# Altium schematic sheet Humidity Regulator.SchDoc
size A3
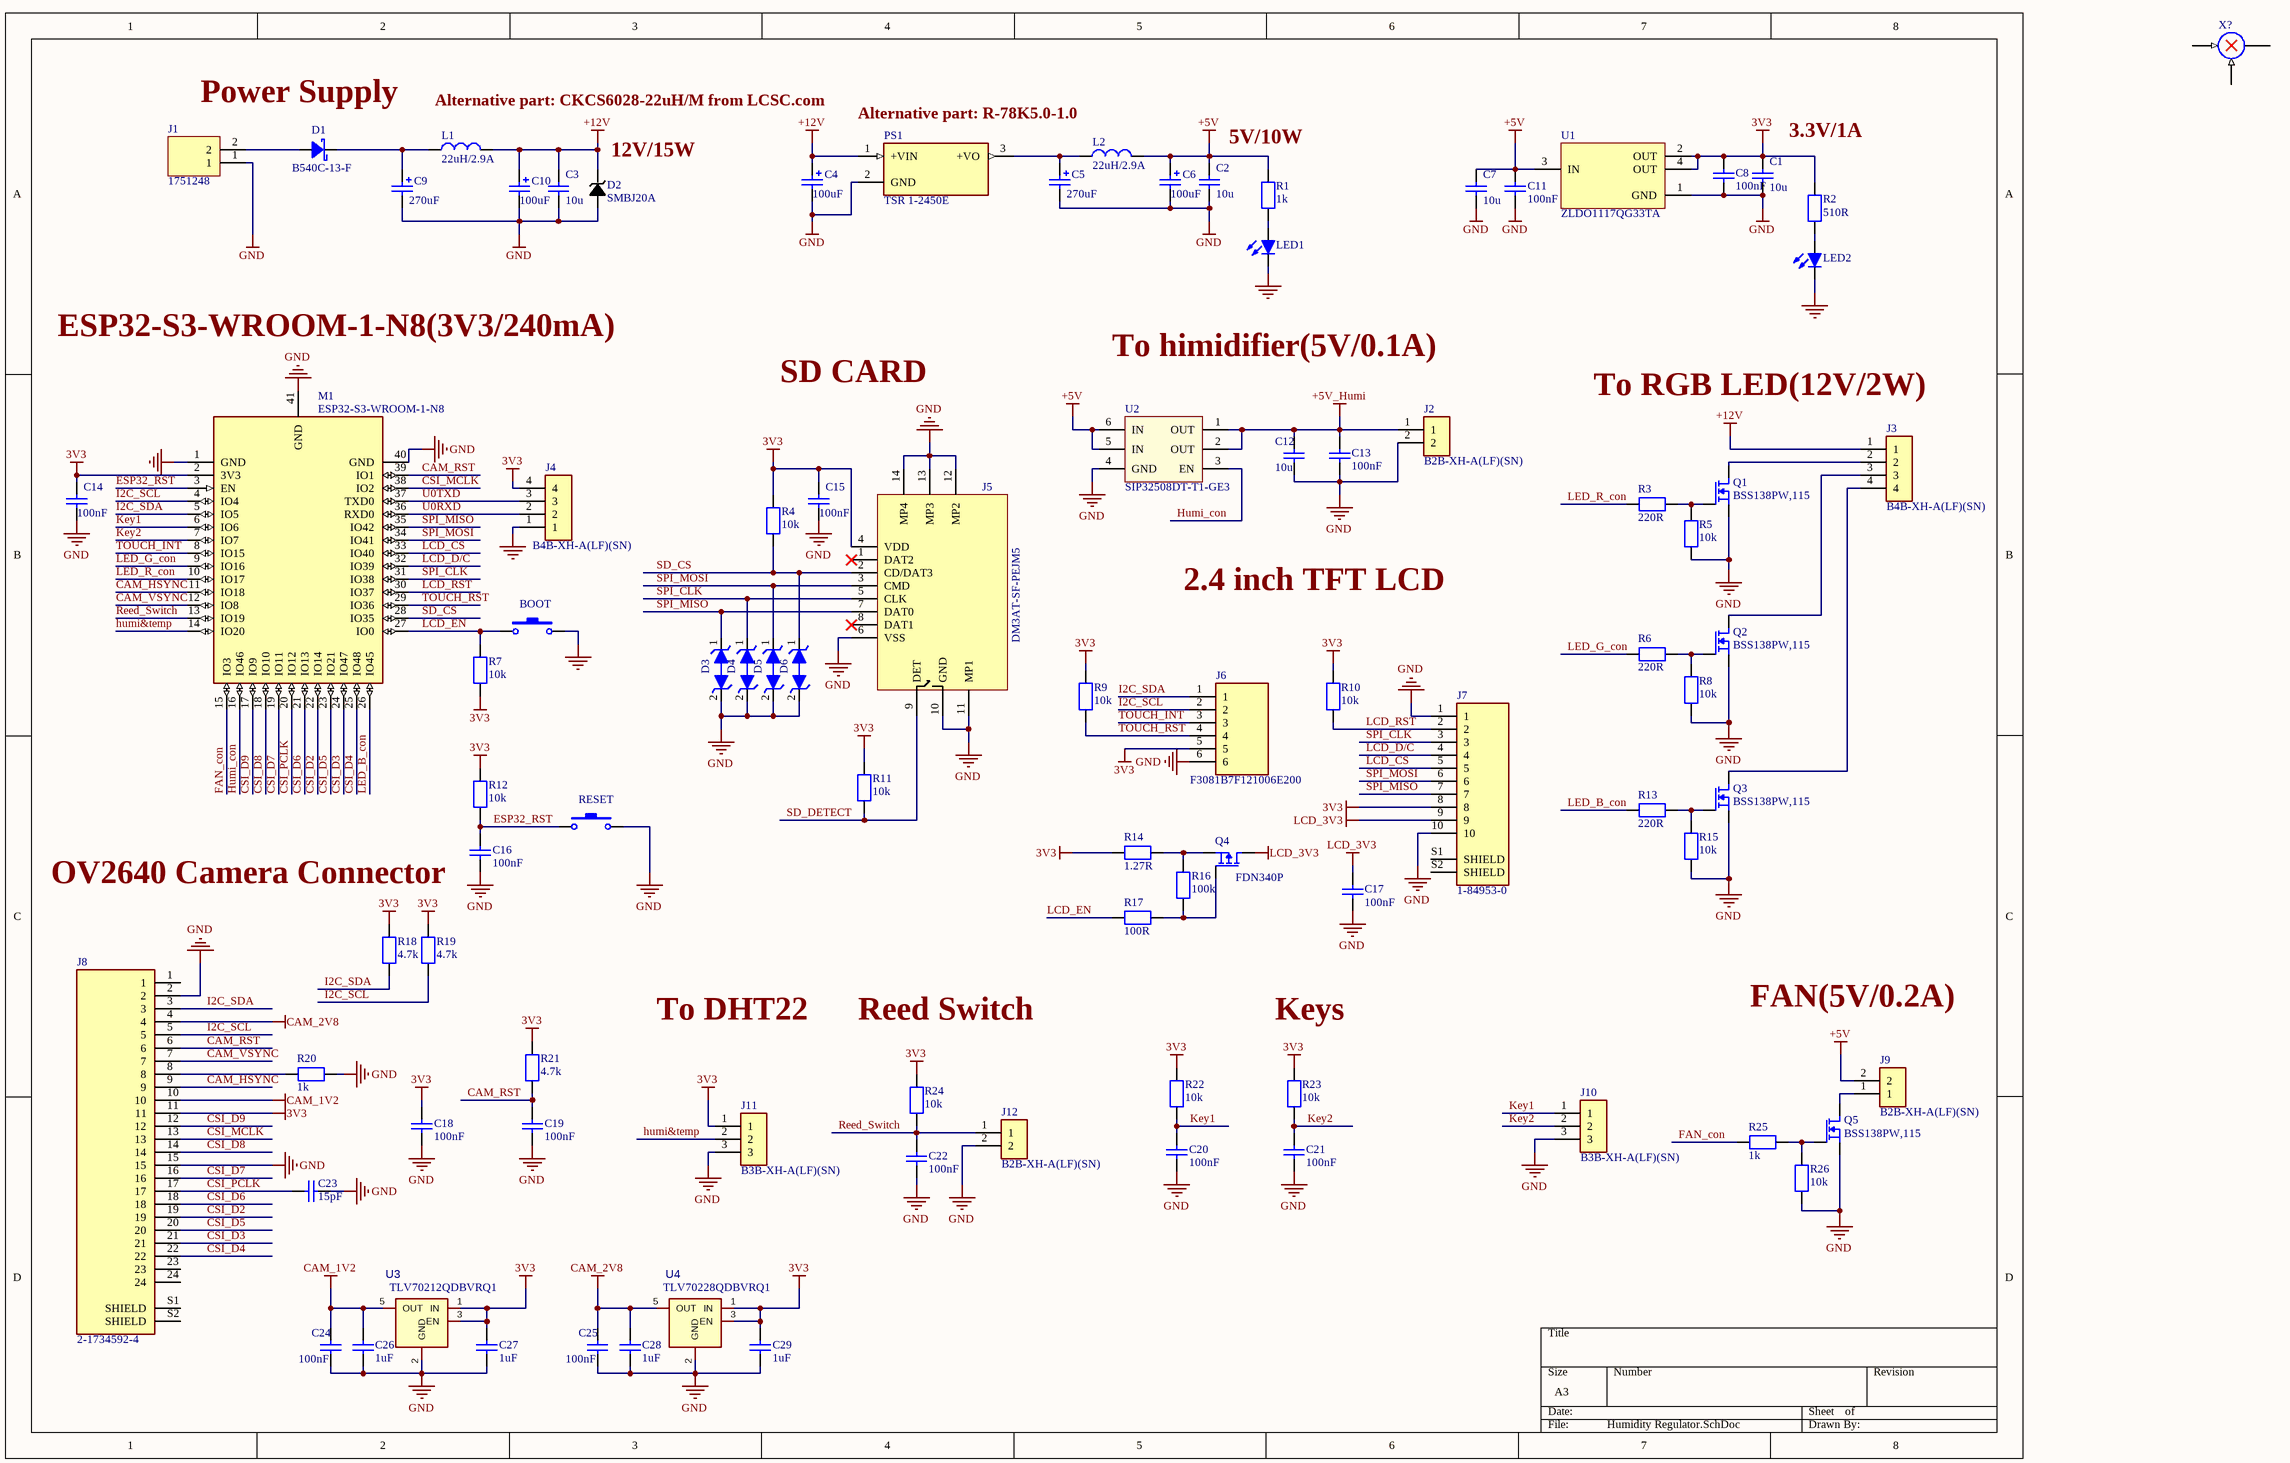
[diagram p0: Humidity Regulator.SchDoc]

## Parts
BOOT  TL3305BF260QG  [SW_TL3305BF260QG]  (value not drawn)
C1  10u  [C1206]
C2  10u  [C1206]
C3  10u  [C1206]
C4  100uF  [CAP_EEUFC1E101S]
C5  270uF  [CAP_EEU-FK1E271B]
C6  100uF  [CAP_EEUFC1E101S]
C7  10u  [C1206]
C8  100nF  [C0603]
C9  270uF  [CAP_EEU-FK1E271B]
C10  100uF  [CAP_EEUFC1E101S]
C11  100nF  [C0603]
C12  10u  [C1206]
C13  100nF  [C0603]
C14  100nF  [C0603]
C15  100nF  [C0603]
C16  100nF  [C0603]
C17  100nF  [C0603]
C18  100nF  [C0603]
C19  100nF  [C0603]
C20  100nF  [C0603]
C21  100nF  [C0603]
C22  100nF  [C0603]
C23  15pF  [C0603]
C24  100nF  [C0603]
C25  100nF  [C0603]
C26  1uF  [C0603]
C27  1uF  [C0603]
C28  1uF  [C0603]
C29  1uF  [C0603]
D1  B540C-13-F  [DO-214AB2]
D2  SMBJ20A  [DO-214AA2]
D3  ESD9B3.3ST5G  [SOD1006X40N_BI]  (value not drawn)
D4  ESD9B3.3ST5G  [SOD1006X40N_BI]  (value not drawn)
D5  ESD9B3.3ST5G  [SOD1006X40N_BI]  (value not drawn)
D6  ESD9B3.3ST5G  [SOD1006X40N_BI]  (value not drawn)
J1  1751248  [1751248]
J2  B2B-XH-A(LF)(SN)  [JST_B2B-XH-A(LF)(SN)]
J3  B4B-XH-A(LF)(SN)  [JST_B4B-XH-A(LF)(SN)]
J4  B4B-XH-A(LF)(SN)  [JST_B4B-XH-A(LF)(SN)]
J5  DM3AT-SF-PEJM5  [HIROSE_DM3AT-SF-PEJM5]
J6  F3081B7F121006E200  [F3081B7F121006E200]
J7  1-84953-0  [TE_1-84953-0]
J8  2-1734592-4  [TE_2-1734592-4]
J9  B2B-XH-A(LF)(SN)  [JST_B2B-XH-A(LF)(SN)]
J10  B3B-XH-A(LF)(SN)  [JST_B3B-XH-A(LF)(SN)]
J11  B3B-XH-A(LF)(SN)  [JST_B3B-XH-A(LF)(SN)]
J12  B2B-XH-A(LF)(SN)  [JST_B2B-XH-A(LF)(SN)]
L1  22uH/2.9A  [IND_SRP6030]
L2  22uH/2.9A  [IND_SRP6030]
LED1  SML-D12U1WT86  [LED0603]  (value not drawn)
LED2  SML-D12U1WT86  [LED0603]  (value not drawn)
M1  ESP32-S3-WROOM-1-N8  [ESP32-S3-WROOM-1-N8]
PS1  TSR 1-2450E  [TSR12450E]
Q1  BSS138PW,115  [SOT323-3]
Q2  BSS138PW,115  [SOT323-3]
Q3  BSS138PW,115  [SOT323-3]
Q4  FDN340P  [SOT23]
Q5  BSS138PW,115  [SOT323-3]
R1  1k  [R0603]
R2  510R  [R0603]
R3  220R  [R0603]
R4  10k  [R0603]
R5  10k  [R0603]
R6  220R  [R0603]
R7  10k  [R0603]
R8  10k  [R0603]
R9  10k  [R0603]
R10  10k  [R0603]
R11  10k  [R0603]
R12  10k  [R0603]
R13  220R  [R0603]
R14  1.27R  [R0603]
R15  10k  [R0603]
R16  100k  [R0603]
R17  100R  [R0603]
R18  4.7k  [R0603]
R19  4.7k  [R0603]
R20  1k  [R0603]
R21  4.7k  [R0603]
R22  10k  [R0603]
R23  10k  [R0603]
R24  10k  [R0603]
R25  1k  [R0603]
R26  10k  [R0603]
RESET  TL3305BF260QG  [SW_TL3305BF260QG]  (value not drawn)
U1  ZLDO1117QG33TA  [SOT223-3]
U2  SIP32508DT-T1-GE3  [TSOT23-6]
U3  TLV70212QDBVRQ1  [SOT23-5]
U4  TLV70228QDBVRQ1  [SOT23-5]
X?  Voltage Multiplier  (value not drawn)

## Nets
3V3: C1.2 C8.2 C14.2 C15.2 C18.2 C27.2 C29.2 J4.4 J5.4(VDD) J6.5 J7.8 J8.11 J11.1 M1.2(3V3) R2.2 R4.1 R7.2 R9.1 R10.1 R11.1 R12.2 R14.1 R18.2 R19.2 R21.2 R22.2 R23.2 R24.2 U1.2(OUT) U1.4(OUT) U3.1(IN) U3.3(EN) U4.1(IN) U4.3(EN)
+5V: C2.2 C6.1 C7.2 C11.2 J9.2 L2.2 R1.2 U1.3(IN) U2.5(IN) U2.6(IN)
+5V_Humi: C12.2 C13.2 J2.1 U2.1(OUT) U2.2(OUT)
+12V: C3.2 C4.1 C10.1 D2.C J3.1 L1.2 PS1.1(+VIN)
CAM_1V2: C24.2 C26.2 J8.10 U3.5(OUT)
CAM_2V8: C25.2 C28.2 J8.4 U4.5(OUT)
GND: BOOT.2 C1.1 C2.1 C3.1 C4.2 C5.2 C6.2 C7.1 C8.1 C9.2 C10.2 C11.1 C12.1 C13.1 C14.1 C15.1 C16.1 C17.1 C18.1 C19.1 C20.1 C21.1 C22.1 C23.1 C24.1 C25.1 C26.1 C27.1 C28.1 C29.1 D2.A D3.2(A) D4.2(A) D5.2(A) D6.2(A) J1.1 J2.2 J4.1 J5.6(VSS) J5.10(GND) J5.11(MP1) J5.12(MP2) J5.13(MP3) J5.14(MP4) J6.6 J7.1 J7.10 J8.2 J8.15 J10.3 J11.3 J12.2 LED1.C LED2.C M1.1(GND) M1.40(GND) M1.41(GND) PS1.2(GND) Q1.2(S) Q2.2(S) Q3.2(S) Q5.2(S) R5.1 R8.1 R15.1 R20.2 R26.1 RESET.2 U1.1(GND) U2.4(GND) U3.2(GND) U4.2(GND)
LCD_3V3: C17.2 J7.9 Q4.3(D)
CAM_HSYNC: J8.9 M1.11(IO18)
CAM_RST: C19.2 J8.6 M1.39(IO1) R21.1
CAM_VSYNC: J8.7 M1.12(IO8)
CSI_D2: J8.19 M1.22(IO14)
CSI_D3: J8.21 M1.24(IO47)
CSI_D4: J8.22 M1.25(IO48)
CSI_D5: J8.20 M1.23(IO21)
CSI_D6: J8.18 M1.21(IO13)
CSI_D7: J8.16 M1.19(IO11)
CSI_D8: J8.14 M1.18(IO10)
CSI_D9: J8.12 M1.17(IO9)
CSI_MCLK: J8.13 M1.38(IO2)
CSI_PCLK: C23.2 J8.17 M1.20(IO12)
ESP32_RST: C16.2 M1.3(EN) R12.1 RESET.1
FAN_con: M1.15(IO3) R25.1
humi&temp: J11.2 M1.14(IO20)
Humi_con: M1.16(IO46) U2.3(EN)
I2C_SCL: J6.2 J8.5 M1.4(IO4) R19.1
I2C_SDA: J6.1 J8.3 M1.5(IO5) R18.1
Key1: C20.2 J10.1 M1.6(IO6) R22.1
Key2: C21.2 J10.2 M1.7(IO7) R23.1
LCD_CS: J7.5 M1.33(IO40)
LCD_D/C: J7.4 M1.32(IO39)
LCD_EN: BOOT.1 M1.27(IO0) R7.1 R17.1
LCD_RST: J7.2 M1.30(IO37) R10.2
LED_B_con: M1.26(IO45) R13.1
LED_G_con: M1.9(IO16) R6.1
LED_R_con: M1.10(IO17) R3.1
Reed_Switch: C22.2 J12.1 M1.13(IO19) R24.1
SD_CS: D6.1(K) J5.2(CD/DAT3) M1.28(IO35) R4.2
SD_DETECT: J5.9(DET) R11.2
SPI_CLK: D4.1(K) J5.5(CLK) J7.3 M1.31(IO38)
SPI_MISO: D3.1(K) J5.7(DAT0) J7.7 M1.35(IO42)
SPI_MOSI: D5.1(K) J5.3(CMD) J7.6 M1.34(IO41)
TOUCH_INT: J6.3 M1.8(IO15)
TOUCH_RST: J6.4 M1.29(IO36) R9.2
U0RXD: J4.2 M1.36(RXD0)
U0TXD: J4.3 M1.37(TXD0)
NetC5_1: C5.1 L2.1 PS1.3(+VO)
NetC9_1: C9.1 D1.C L1.1
NetD1_A: D1.A J1.2
NetJ3_2: J3.2 Q1.3(D)
NetJ3_3: J3.3 Q2.3(D)
NetJ3_4: J3.4 Q3.3(D)
NetJ8_8: J8.8 R20.1
NetJ9_1: J9.1 Q5.3(D)
NetLED1_A: LED1.A R1.1
NetLED2_A: LED2.A R2.1
NetQ1_1: Q1.1(G) R3.2 R5.2
NetQ2_1: Q2.1(G) R6.2 R8.2
NetQ3_1: Q3.1(G) R13.2 R15.2
NetQ4_1: Q4.1(G) R16.1 R17.2
NetQ4_2: Q4.2(S) R14.2 R16.2
NetQ5_1: Q5.1(G) R25.2 R26.2

Not connected (* = marked no-connect by the designer): J5 1(DAT2)* 8(DAT1)*; J7 S1(SHIELD) S2(SHIELD); J8 1 23 24 S1(SHIELD) S2(SHIELD); U3 4(NC); U4 4(NC); X? 1 2 3

## Notes on the sheet
- Power Supply
- (near L1) Alternative part: CKCS6028-22uH/M from LCSC.com
- (near D2) 12V/15W
- Alternative part: R-78K5.0-1.0
- 5V/10W
- 3.3V/1A
- ESP32-S3-WROOM-1-N8(3V3/240mA)
- To himidifier(5V/0.1A)
- SD CARD
- (near J3) To RGB LED(12V/2W)
- 2.4 inch TFT LCD
- OV2640 Camera Connector
- To DHT22
- Reed Switch
- Keys
- FAN(5V/0.2A)

## Library data of the parts
BOOT RESET = TL3305BF260QG: SWITCH TACTILE SPST-NO 0.05A 12V; Manufacturer: E-Switch; Value: TL3305BF260QG; Manufacturer Part Number: TL3305BF260QG; Supplier: Mouser; Supplier Part Number: 612-TL3305BF260QG; Price: 0.25
C1-C3 C7 C12 = 10uF ± 10% 25V: Manufacturer: Yageo; Manufacturer Part Number: CC1206KKX7R8BB106; Tolerance: +-10%; Type: X7R; Voltage (V): 25; Category: Capacitor; Value: 10u; Price: 0.44; Supplier: Mouser; Supplier Part Number: 603-CC126KKX7R8BB106
C4 C6 C10 = EEU-FC1E101S: CAP ALUM 100UF 20% 25V SMD; Manufacturer: Panasonic; Manufacturer Part Number: EEU-FC1E101S; Value: 100uF; Supplier: Mouser; Supplier Part Number: 667-EEU-FC1E101S; Price: 0.4
C5 C9 = EEU-FC1E271B: CAP ALUM 270UF 20% 25V SMD; Manufacturer: Panasonic; Manufacturer Part Number: EEU-FC1E271B; Value: 270uF; Supplier: Mouser; Supplier Part Number: 667-EEU-FC1E271B; Price: 0.7
C8 C11 C13-C22 C24 C25 = 100nF ± 10% 50V: Manufacturer: Yageo; Manufacturer Part Number: CC0603KRX7R9BB104; Value: 100nF; Supplier: Mouser; Supplier Part Number: 603-CC603KRX7R9BB104; Price: 0.1
C23 = 15pF ± 5% 50V: Manufacturer: Yageo; Manufacturer Part Number: CC0603JRNPO9BN150; Value: 15pF; Supplier: Mouser; Supplier Part Number: 603-CC0603JRNPO9BN150; Price: 0.1
C26-C29 = 1uF ± 10% 16V: Manufacturer: Yageo; Manufacturer Part Number: CC0603KRX5R7BB105; Value: 1uF; Supplier: Mouser; Supplier Part Number: 603-CC603KRX5R7BB105; Price: 0.1
D1 = B540C-13-F: Schottky Diodes & Rectifiers 40V 5A; Value: B540C-13-F; Manufacturer Part Number: B540C-13-F; Manufacturer: Diodes; Supplier: Mouser; Supplier Part Number: 621-B540C-F; Price: 0.5
D2 = ZM4746A-GS08: ESD Suppressors / TVS Diodes 600W, 23.4V, 5%, Unidirectional, TVS; Manufacturer: Littelfuse; Value: SMBJ20A; Manufacturer Part Number: SMBJ20A; Supplier: Mouser; Supplier Part Number: 576-SMBJ20A; Price: 0.35
D3-D6 = TVS DIODE 3.3VWM 11.5VC SOD923: 11.5V Clamp 2A (8/20µs) Ipp Tvs Diode Surface Mount SOD-923; Manufacturer: ON Semiconductor; Manufacturer Part Number: ESD9B3.3ST5G; Value: ESD9B3.3ST5G; Supplier: Mouser; Supplier Part Number: 863-ESD9B3.3ST5G; Price: 0.24
J1 = 1751248: PCB terminal block, 3.5mm pitch, 2 way Phoenix Contact COMBICON MKDS Series 3.5mm Pitch Straight PCB Terminal Block with Screw Termination, Through Hole; Supplier Part Number: 651-1751248; Price: 1.2; Manufacturer: Phoenix Contact; Manufacturer Part Number: 1751248; Supplier: Mouser; Value: 1751248
J2 J9 J12 = B2B-XH-A(LF)(SN): Connector Header Through Hole 2 position 0.098 (2.50mm); Manufacturer: JST Sales America Inc.; Value: B2B-XH-A(LF)(SN); Manufacturer Part Number: B2B-XH-A(LF)(SN)
J3 J4 = B4B-XH-A(LF)(SN): Connector Header Through Hole 4 position 0.098 (2.50mm); Manufacturer: JST Sales; Manufacturer Part Number: B4B-XH-A(LF)(SN); Value: B4B-XH-A(LF)(SN)
J5 = CONN MICRO SD CARD PUSH-PUSH R/A: Manufacturer: Hirose Electric Co Ltd; Price: 2.8; Supplier: Mouser; Supplier Part Number: 798-DM3AT-SF-PEJM5; Manufacturer Part Number: DM3AT-SF-PEJM5; Value: DM3AT-SF-PEJM5
J6 = F3081B7F121006E200: FFC & FPC Connectors F308-1B7F1-21006-E20 #VALUE!; Manufacturer: Amphenol Aorora; Manufacturer Part Number: F3081B7F121006E200; Price: 0.507; Value: F3081B7F121006E200; Supplier: Mouser; Supplier Part Number: 649-F3081B7F006E200
J7 = 1-84953-0: FFC & FPC Connectors 1MM CONT ASSY 10P; Manufacturer: TE Connectivity; Manufacturer Part Number: 1-84953-0; Price: 1.05; Value: 1-84953-0; Supplier: Mouser; Supplier Part Number: 571-1-84953-0
J8 = 2-1734592-4: 24 Position FPC Connector Contacts, Bottom 0.020" _0.50mm_ Surface Mount, Right Angle; Manufacturer: TE Connectivity; Manufacturer Part Number: 2-1734592-4; Value: 2-1734592-4; Price: 1.32; Supplier: Mouser; Supplier Part Number: 571-2-1734592-4
J10 J11 = B3B-XH-A(LF)(SN): Connector Header Through Hole 3 position 0.098 (2.50mm); Manufacturer: JST Sales; Value: B3B-XH-A(LF)(SN); Manufacturer Part Number: B3B-XH-A(LF)(SN)
L1 L2 = SRP6030WA-220M: Power Inductors - SMD Ind,7.1x6.6x2.8mm,22uH+/-20%,2.9A,shd; Manufacturer: Bourns; Manufacturer Part Number: SRP6030WA-220M; Value: 22uH/2.9A; Supplier: Mouser; Supplier Part Number: 652-SRP6030WA-220M; Price: 1.2
LED1 LED2 = SML-D12U1WT86: Typical RED GaAs LED; Manufacturer: Rohm Semiconductor; Supplier: Mouser; Supplier Part Number: 755-SML-D12U1WT86; Manufacturer Part Number: SML-D12U1WT86; Value: SML-D12U1WT86; Price: 0.2
M1 = ESP32-S3-WROOM-1-N8: Bluetooth, WiFi 802.11b/g/n, Bluetooth v5.0 Transceiver Module 2.4GHz PCB Trace Surface Mount; Manufacturer: Espressif Systems; Price: 3.45; Value: ESP32-S3-WROOM-1-N8; Supplier Part Number: 356-ESP32-S3WROOM1N8; Manufacturer Part Number: ESP32-S3-WROOM-1-N8; Supplier: Mouser
PS1 = TSR 1-2450E: 2 A Output Current, 6~36 Vdc Input, SIP, Non-Isolated, Dc-Dc Converter; Manufacturer: TRACO Power; Price: 3.7; Supplier: Mouser; Value: TSR 1-2450E; Supplier Part Number: 495-TSR1-2450E; Manufacturer Part Number: TSR 1-2450E
Q1-Q3 Q5 = BSS138PW,115: MOSFET, N CH, 60V, 0.2A; Manufacturer: Nexperia; Value: BSS138PW,115; Manufacturer Part Number: BSS138PW,115; Supplier: Mouser; Supplier Part Number: 771-BSS138PW115; Price: 0.3
Q4 = FDN340P: MOSFET SSOT-3 P-CH -20V; Manufacturer: onsemi; Value: FDN340P; Manufacturer Part Number: FDN340P; Supplier: Mouser; Supplier Part Number: 512-FDN340P; Price: 0.46
R1 R20 R25 = 1 kOhms ±1% 0.1W: Manufacturer: Yageo; Manufacturer Part Number: RC0603FR-071KL; Value: 1k; Supplier: Mouser; Supplier Part Number: 603-RC0603FR-071KL; Price: 0.1
R2 = 510 Ohm ±1% 0.1W: Manufacturer: Yageo; Manufacturer Part Number: RC0603FR-07510RL; Value: 510R; Supplier: Mouser; Supplier Part Number: 603-RC0603FR-07510RL; Price: 0.1
R3 R6 R13 = 220 Ohm ±1% 0.1W: Manufacturer: Yageo; Manufacturer Part Number: RC0603FR-07220RL; Value: 220R; Supplier: Mouser; Supplier Part Number: 603-RC0603FR-07220RL; Price: 0.1
R4 R5 R7-R12 R15 R22-R24 R26 = 10 kOhms ±1% 0.1W: Manufacturer: Yageo; Manufacturer Part Number: RC0603FR-0710KL; Value: 10k; Supplier: Mouser; Supplier Part Number: 603-RC0603FR-0710KL; Price: 0.1
R14 = 1.27 Ohm ±1% 0.1W: Manufacturer: Yageo; Manufacturer Part Number: RC0603FR-071R27L; Value: 1.27R; Supplier: Mouser; Supplier Part Number: 603-RC0603FR-071R27L; Price: 0.1
R16 = 100 kOhms ±1% 0.1W: Manufacturer: Yageo; Manufacturer Part Number: RC0603FR-07100KL; Value: 100k; Supplier: Mouser; Supplier Part Number: 603-RC0603FR-07100KL; Price: 0.1
R17 = 100 Ohm ±1% 0.1W: Manufacturer: Yageo; Manufacturer Part Number: RC0603FR-07100RL; Value: 100R; Supplier: Mouser; Supplier Part Number: 603-RC0603FR-07100RL; Price: 0.1
R18 R19 R21 = 4.7 kOhms ±1% 0.1W: Manufacturer: Yageo; Manufacturer Part Number: RC0603FR-074K7L; Value: 4.7k; Supplier: Mouser; Supplier Part Number: 603-RC0603FR-074K7L; Price: 0.1
U1 = ZLDO1117QG33TA: LDO Voltage Regulators 1A Low Dropout 1.2V Adj or Fixed; Manufacturer: Diodes Incorporated; Price: 0.63; Manufacturer Part Number: ZLDO1117QG33TA; Supplier Part Number: 621-ZLDO1117QG33TA; Value: ZLDO1117QG33TA; Supplier: Mouser
U2 = SIP32508DT-T1-GE3: Power Switch ICs - Power Distribution Slew Rate Controlled Load Switch; Manufacturer: Vishay / Siliconix; Value: SIP32508DT-T1-GE3; Supplier Part Number: 78-SIP32508DT-T1-GE3; Supplier: Mouser; Price: 0.6; Manufacturer Part Number: SIP32508DT-T1-GE3
U3 = TLV70212QDBVRQ1: LDO Regulator Pos 1.2V 0.3A Automotive 5-Pin SOT-23 T/R; Manufacturer: Texas Instruments; Supplier: Mouser; Manufacturer Part Number: TLV70212QDBVRQ1; Supplier Part Number: 595-TLV70212QDBVRQ1; Price: 0.63; Value: TLV70212QDBVRQ1; ComponentLink1URL: http://www.ti.com/general/docs/suppproductinfo.tsp?distId=10&amp;gotoUrl=http%3A%2F%2Fwww.ti.com%2Flit%2Fgpn%2Ftlv702-q1&src-supplier=Digi-Key; ComponentLink1Description: http://www.ti.com/general/docs/suppproductinfo.tsp?distId=10&amp;gotoUrl=http%3A%2F%2Fwww.ti.com%2Flit%2Fgpn%2Ftlv702-q1&src-supplier=Digi-Key
U4 = TLV70228QDBVRQ1: LDO Regulator Pos 2.8V 0.3A Automotive 5-Pin SOT-23 T/R; Manufacturer: Texas Instruments; Supplier: Mouser; Manufacturer Part Number: TLV70228QDBVRQ1; Supplier Part Number: 595-TLV70228QDBVRQ1; Price: 0.42; Value: TLV70228QDBVRQ1; ComponentLink1URL: http://www.ti.com/general/docs/suppproductinfo.tsp?distId=10&amp;gotoUrl=http%3A%2F%2Fwww.ti.com%2Flit%2Fgpn%2Ftlv702-q1&src-supplier=Digi-Key; ComponentLink1Description: http://www.ti.com/general/docs/suppproductinfo.tsp?distId=10&amp;gotoUrl=http%3A%2F%2Fwww.ti.com%2Flit%2Fgpn%2Ftlv702-q1&src-supplier=Digi-Key
X? = Voltage Multiplier: SimulationGenericComponent: True